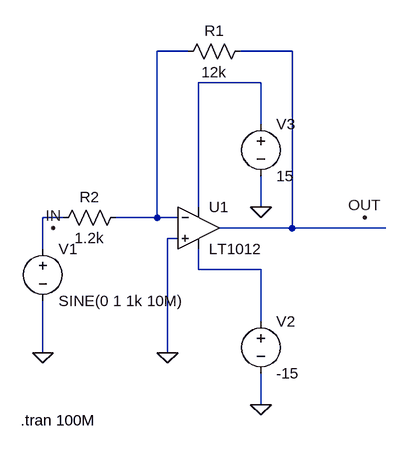
[diagram p0: schematic AmpliOp.Reverser.asc]
AmpliOp.Reverser.asc, the LTspice schematic file:
Version 4
SHEET 1 880 680
WIRE 176 -96 128 -96
WIRE 336 -96 256 -96
WIRE 288 -48 192 -48
WIRE 288 16 288 -48
WIRE 192 144 192 -48
WIRE 288 144 288 96
WIRE -16 160 -48 160
WIRE 128 160 128 -96
WIRE 128 160 64 160
WIRE 160 160 128 160
WIRE 336 176 336 -96
WIRE 336 176 224 176
WIRE 480 176 336 176
WIRE 160 192 144 192
WIRE -48 208 -48 160
WIRE 192 240 192 208
WIRE 288 240 192 240
WIRE 288 320 288 240
WIRE -48 368 -48 288
WIRE 144 368 144 192
WIRE 288 448 288 400
FLAG 144 368 0
FLAG -32 176 IN
FLAG 448 160 OUT
FLAG 288 448 0
FLAG 288 144 0
FLAG -48 368 0
SYMBOL voltage -48 192 R0
WINDOW 123 0 0 Left 2
WINDOW 39 0 0 Left 2
SYMATTR InstName V1
SYMATTR Value SINE(0 1 1k 10M)
SYMBOL res 80 144 R90
WINDOW 0 0 56 VBottom 2
WINDOW 3 32 56 VTop 2
SYMATTR InstName R2
SYMATTR Value 1.2k
SYMBOL voltage 288 304 R0
WINDOW 123 0 0 Left 2
WINDOW 39 0 0 Left 2
SYMATTR InstName V2
SYMATTR Value -15
SYMBOL voltage 288 0 R0
WINDOW 123 0 0 Left 2
WINDOW 39 0 0 Left 2
SYMATTR InstName V3
SYMATTR Value 15
SYMBOL Opamps\\LT1012 192 112 R0
SYMATTR InstName U1
SYMBOL res 272 -112 R90
WINDOW 0 0 56 VBottom 2
WINDOW 3 32 56 VTop 2
SYMATTR InstName R1
SYMATTR Value 12k
TEXT -82 472 Left 2 !.tran 100M

The netlist it stands for:
* AmpliOp.Reverser.asc
V1 N004 0 SINE(0 1 1k 10M)
R2 N001 N004 1.2k
V2 N005 0 -15
V3 N003 0 15
XU1 0 N001 N003 N005 N002 LT1012  ; pins In+ In- V+ V- OUT
R1 N002 N001 12k
.tran 100M
.backanno
.end